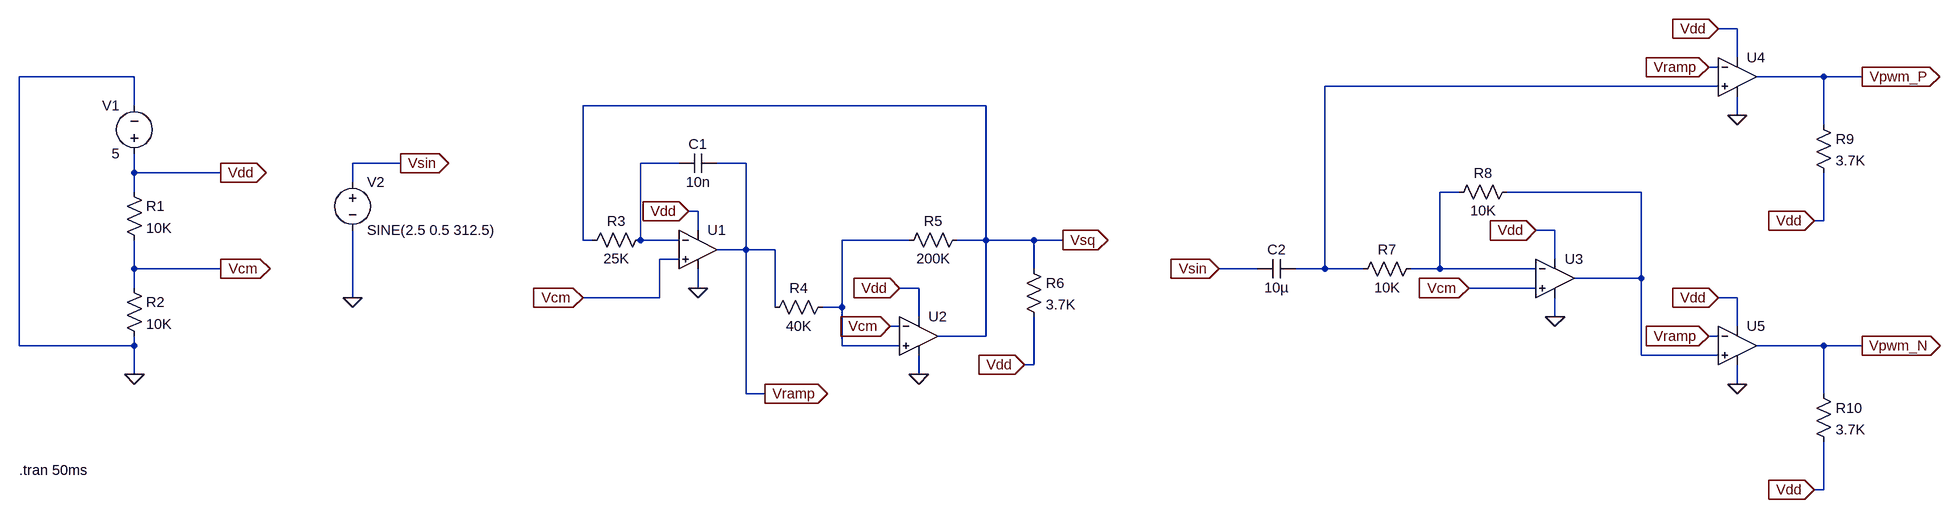
[diagram p0: schematic PWM MODULATOR.asc]
PWM MODULATOR.asc, the LTspice schematic file:
Version 4.1
SHEET 1 3488 680
WIRE 2576 -480 2544 -480
WIRE 2576 -432 2576 -480
WIRE 2544 -416 2528 -416
WIRE -208 -400 -400 -400
WIRE 2720 -400 2608 -400
WIRE 2784 -400 2720 -400
WIRE 2544 -384 1888 -384
WIRE -208 -352 -208 -400
WIRE 1280 -352 608 -352
WIRE 2576 -336 2576 -368
WIRE 2720 -320 2720 -400
WIRE 304 -256 224 -256
WIRE 768 -256 704 -256
WIRE 880 -256 832 -256
WIRE -208 -240 -208 -272
WIRE -64 -240 -208 -240
WIRE 224 -224 224 -256
WIRE -208 -208 -208 -240
WIRE 2112 -208 2080 -208
WIRE 2416 -208 2192 -208
WIRE 800 -176 784 -176
WIRE 2720 -160 2720 -240
WIRE 2720 -160 2704 -160
WIRE 800 -144 800 -176
WIRE 2272 -144 2240 -144
WIRE 608 -128 608 -352
WIRE 624 -128 608 -128
WIRE 704 -128 704 -256
WIRE 768 -128 704 -128
WIRE 1152 -128 1040 -128
WIRE 1280 -128 1280 -352
WIRE 1280 -128 1232 -128
WIRE 1360 -128 1280 -128
WIRE 1408 -128 1360 -128
WIRE 880 -112 880 -256
WIRE 880 -112 832 -112
WIRE 928 -112 880 -112
WIRE 768 -96 736 -96
WIRE 2272 -96 2272 -144
WIRE -208 -80 -208 -128
WIRE -64 -80 -208 -80
WIRE 1360 -80 1360 -128
WIRE 1776 -80 1712 -80
WIRE 1888 -80 1888 -384
WIRE 1888 -80 1840 -80
WIRE 1952 -80 1888 -80
WIRE 2080 -80 2080 -208
WIRE 2080 -80 2032 -80
WIRE 2240 -80 2080 -80
WIRE 2416 -64 2416 -208
WIRE 2416 -64 2304 -64
WIRE -208 -48 -208 -80
WIRE 800 -48 800 -80
WIRE 1168 -48 1136 -48
WIRE 2240 -48 2128 -48
WIRE 224 -32 224 -144
WIRE 736 -32 736 -96
WIRE 736 -32 608 -32
WIRE 2576 -32 2544 -32
WIRE 928 -16 928 -112
WIRE 1040 -16 1040 -128
WIRE 1040 -16 1008 -16
WIRE 1168 0 1168 -48
WIRE 2272 0 2272 -32
WIRE 1136 16 1120 16
WIRE 2576 16 2576 -32
WIRE 1280 32 1280 -128
WIRE 1280 32 1200 32
WIRE 2544 32 2528 32
WIRE -400 48 -400 -400
WIRE -208 48 -208 32
WIRE -208 48 -400 48
WIRE 1040 48 1040 -16
WIRE 1136 48 1040 48
WIRE 2720 48 2608 48
WIRE 2784 48 2720 48
WIRE 2416 64 2416 -64
WIRE 2544 64 2416 64
WIRE 1360 80 1360 0
WIRE 1360 80 1344 80
WIRE -208 96 -208 48
WIRE 1168 96 1168 64
WIRE 2576 112 2576 80
WIRE 880 128 880 -112
WIRE 912 128 880 128
WIRE 2720 128 2720 48
WIRE 2720 288 2720 208
WIRE 2720 288 2704 288
FLAG -208 96 0
FLAG -64 -80 Vcm
IOPIN -64 -80 Out
FLAG -64 -240 Vdd
IOPIN -64 -240 Out
FLAG 608 -32 Vcm
IOPIN 608 -32 In
FLAG 784 -176 Vdd
IOPIN 784 -176 In
FLAG 1136 -48 Vdd
IOPIN 1136 -48 In
FLAG 800 -48 0
FLAG 1168 96 0
FLAG 1120 16 Vcm
IOPIN 1120 16 In
FLAG 912 128 Vramp
IOPIN 912 128 Out
FLAG 1408 -128 Vsq
IOPIN 1408 -128 Out
FLAG 1344 80 Vdd
IOPIN 1344 80 In
FLAG 2240 -144 Vdd
IOPIN 2240 -144 In
FLAG 2272 0 0
FLAG 2128 -48 Vcm
IOPIN 2128 -48 In
FLAG 1712 -80 Vsin
IOPIN 1712 -80 In
FLAG 224 -32 0
FLAG 304 -256 Vsin
IOPIN 304 -256 Out
FLAG 2544 -480 Vdd
IOPIN 2544 -480 In
FLAG 2576 -336 0
FLAG 2528 -416 Vramp
IOPIN 2528 -416 In
FLAG 2544 -32 Vdd
IOPIN 2544 -32 In
FLAG 2576 112 0
FLAG 2528 32 Vramp
IOPIN 2528 32 In
FLAG 2784 -400 Vpwm_P
IOPIN 2784 -400 Out
FLAG 2784 48 Vpwm_N
IOPIN 2784 48 Out
FLAG 2704 -160 Vdd
IOPIN 2704 -160 In
FLAG 2704 288 Vdd
IOPIN 2704 288 In
SYMBOL res -224 -224 R0
SYMATTR InstName R1
SYMATTR Value 10K
SYMBOL res -224 -64 R0
SYMATTR InstName R2
SYMATTR Value 10K
SYMBOL OpAmps\\UniversalOpAmp1 800 -112 R0
SYMATTR InstName U1
SYMBOL res 720 -144 R90
WINDOW 0 0 56 VBottom 2
WINDOW 3 32 56 VTop 2
SYMATTR InstName R3
SYMATTR Value 25K
SYMBOL voltage -208 -256 R180
WINDOW 0 24 96 Left 2
WINDOW 3 24 16 Left 2
WINDOW 123 0 0 Left 0
WINDOW 39 0 0 Left 0
SYMATTR InstName V1
SYMATTR Value 5
SYMBOL OpAmps\\UniversalOpAmp2 1168 32 R0
SYMATTR InstName U2
SYMBOL res 1024 -32 R90
WINDOW 0 0 56 VBottom 2
WINDOW 3 32 56 VTop 2
SYMATTR InstName R4
SYMATTR Value 40K
SYMBOL res 1248 -144 R90
WINDOW 0 0 56 VBottom 2
WINDOW 3 32 56 VTop 2
SYMATTR InstName R5
SYMATTR Value 200K
SYMBOL cap 832 -272 R90
WINDOW 0 0 32 VBottom 2
WINDOW 3 32 32 VTop 2
SYMATTR InstName C1
SYMATTR Value 10n
SYMBOL res 1344 -96 R0
SYMATTR InstName R6
SYMATTR Value 3.7K
SYMBOL OpAmps\\UniversalOpAmp2 2272 -64 R0
SYMATTR InstName U3
SYMBOL res 2048 -96 R90
WINDOW 0 0 56 VBottom 2
WINDOW 3 32 56 VTop 2
SYMATTR InstName R7
SYMATTR Value 10K
SYMBOL res 2208 -224 R90
WINDOW 0 0 56 VBottom 2
WINDOW 3 32 56 VTop 2
SYMATTR InstName R8
SYMATTR Value 10K
SYMBOL cap 1776 -96 M90
WINDOW 0 0 32 VBottom 2
WINDOW 3 32 32 VTop 2
SYMATTR InstName C2
SYMATTR Value 10µ
SYMATTR SpiceLine Irms=0
SYMBOL voltage 224 -240 R0
WINDOW 123 0 0 Left 0
WINDOW 39 0 0 Left 0
SYMATTR InstName V2
SYMATTR Value SINE(2.5 0.5 312.5)
SYMBOL OpAmps\\UniversalOpAmp2 2576 -400 R0
SYMATTR InstName U4
SYMBOL OpAmps\\UniversalOpAmp2 2576 48 R0
SYMATTR InstName U5
SYMBOL res 2704 -336 R0
SYMATTR InstName R9
SYMATTR Value 3.7K
SYMBOL res 2704 112 R0
SYMATTR InstName R10
SYMATTR Value 3.7K
TEXT -400 256 Left 2 !.tran 50ms

The netlist it stands for:
* PWM MODULATOR.asc
R1 Vdd Vcm 10K
R2 Vcm 0 10K
X§U1 Vcm N002 Vdd 0 Vramp level1 Avol=1Meg GBW=10Meg Vos=0 En=0 Enk=0 In=0 Ink=0 Rin=500Meg  ; pins In+ In- V+ V- OUT
R3 N002 Vsq 25K
V1 Vdd 0 5
X§U2 N005 Vcm Vdd 0 Vsq level2 Avol=1Meg GBW=10Meg Slew=10Meg Ilimit=25m Rail=0 Vos=0 En=0 Enk=0 In=0 Ink=0 Rin=500Meg  ; pins In+ In- V+ V- OUT
R4 N005 Vramp 40K
R5 Vsq N005 200K
C1 Vramp N002 10n
R6 Vsq Vdd 3.7K
X§U3 Vcm N003 Vdd 0 N004 level2 Avol=1Meg GBW=10Meg Slew=10Meg Ilimit=25m Rail=0 Vos=0 En=0 Enk=0 In=0 Ink=0 Rin=500Meg  ; pins In+ In- V+ V- OUT
R7 N003 N001 10K
R8 N004 N003 10K
C2 Vsin N001 10µ Irms=0
V2 Vsin 0 SINE(2.5 0.5 312.5)
X§U4 N001 Vramp Vdd 0 Vpwm_P level2 Avol=1Meg GBW=10Meg Slew=10Meg Ilimit=25m Rail=0 Vos=0 En=0 Enk=0 In=0 Ink=0 Rin=500Meg  ; pins In+ In- V+ V- OUT
X§U5 N004 Vramp Vdd 0 Vpwm_N level2 Avol=1Meg GBW=10Meg Slew=10Meg Ilimit=25m Rail=0 Vos=0 En=0 Enk=0 In=0 Ink=0 Rin=500Meg  ; pins In+ In- V+ V- OUT
R9 Vpwm_P Vdd 3.7K
R10 Vpwm_N Vdd 3.7K
.tran 50ms
.lib UniversalOpAmp1.lib
.lib UniversalOpAmp2.lib
.backanno
.end